# Altium project RS232-Ethernet_Bridge.PrjPcb
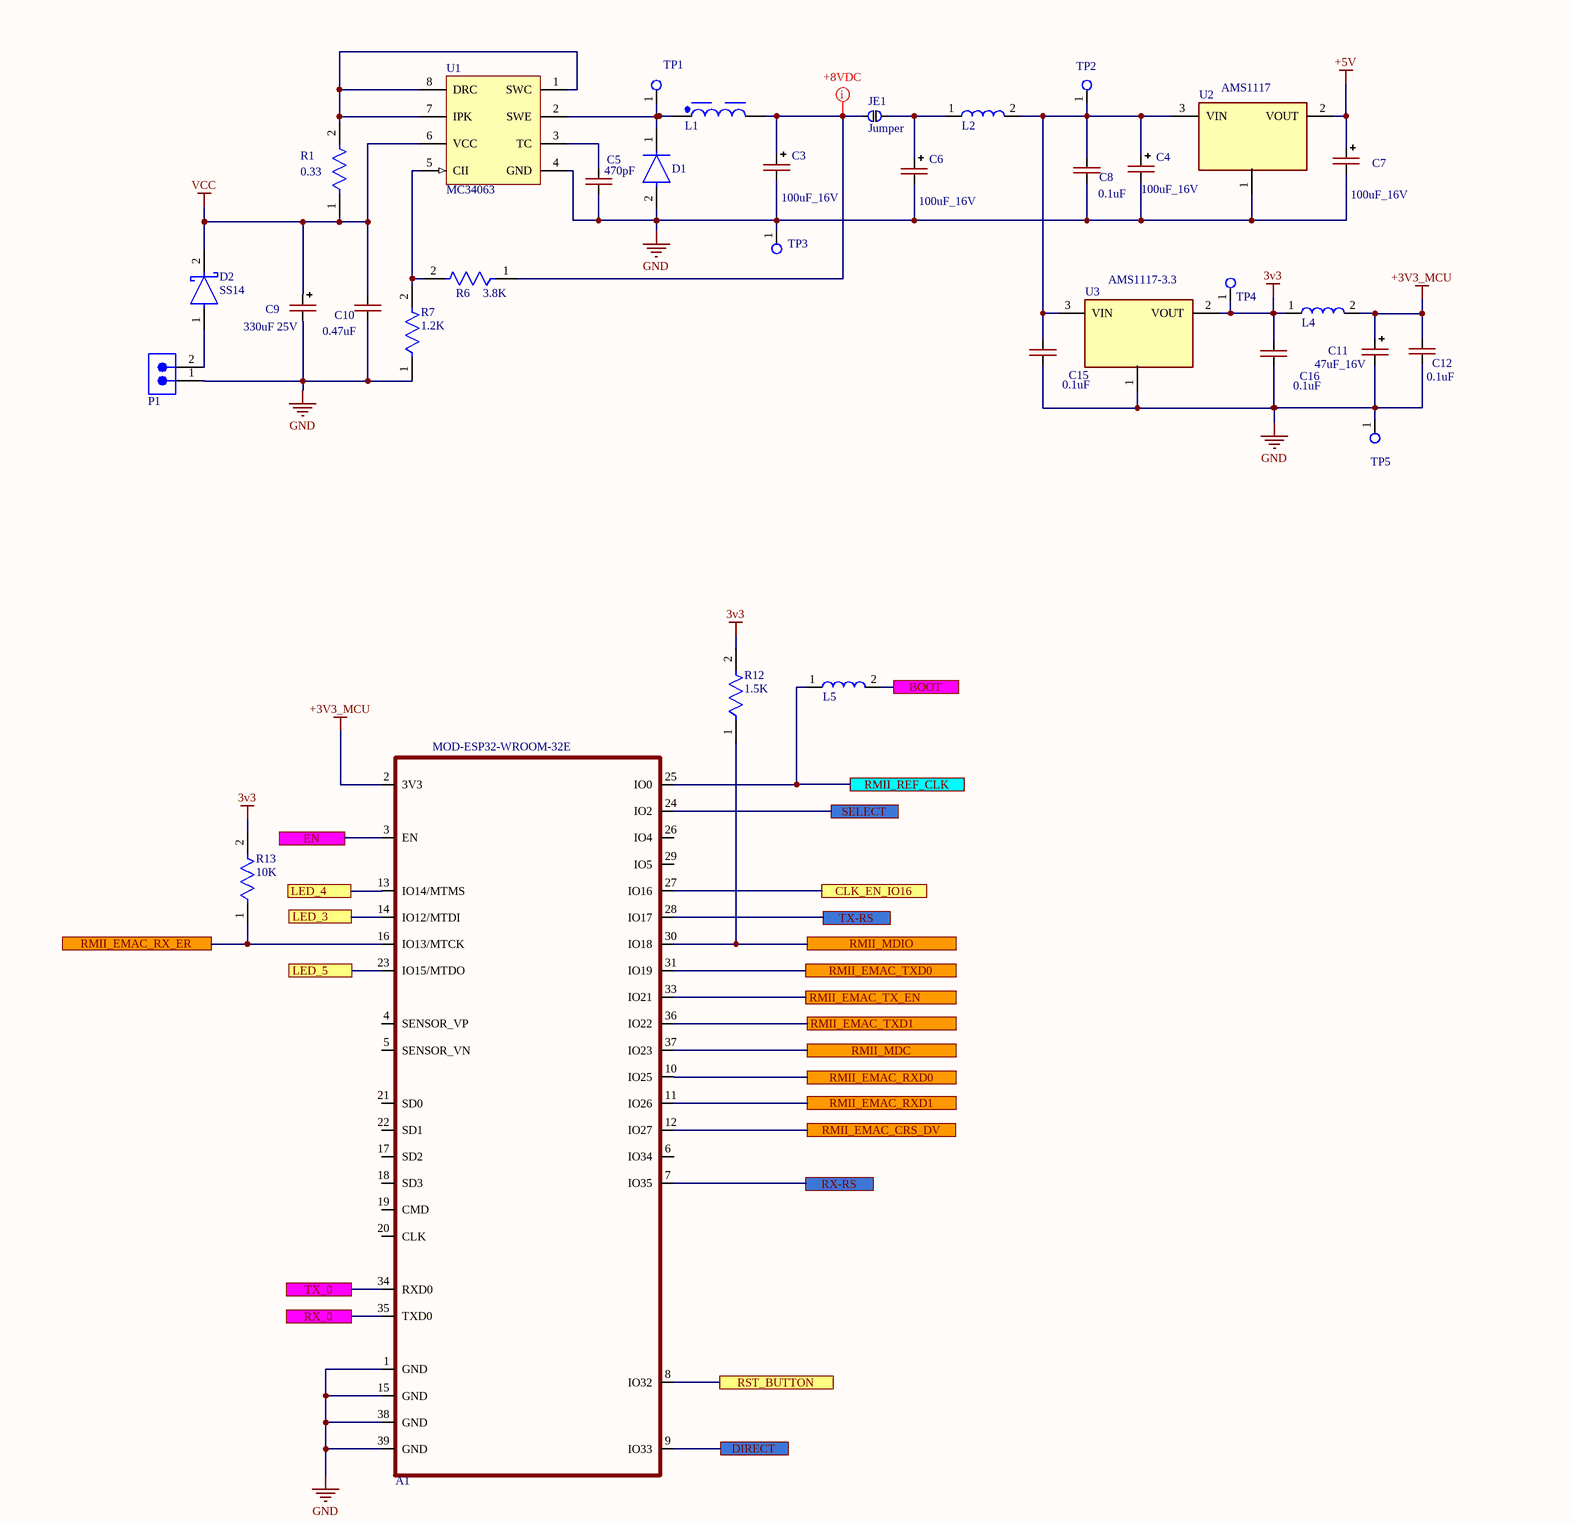
[diagram p0: Ethernet_bridge.SchDoc, top left]
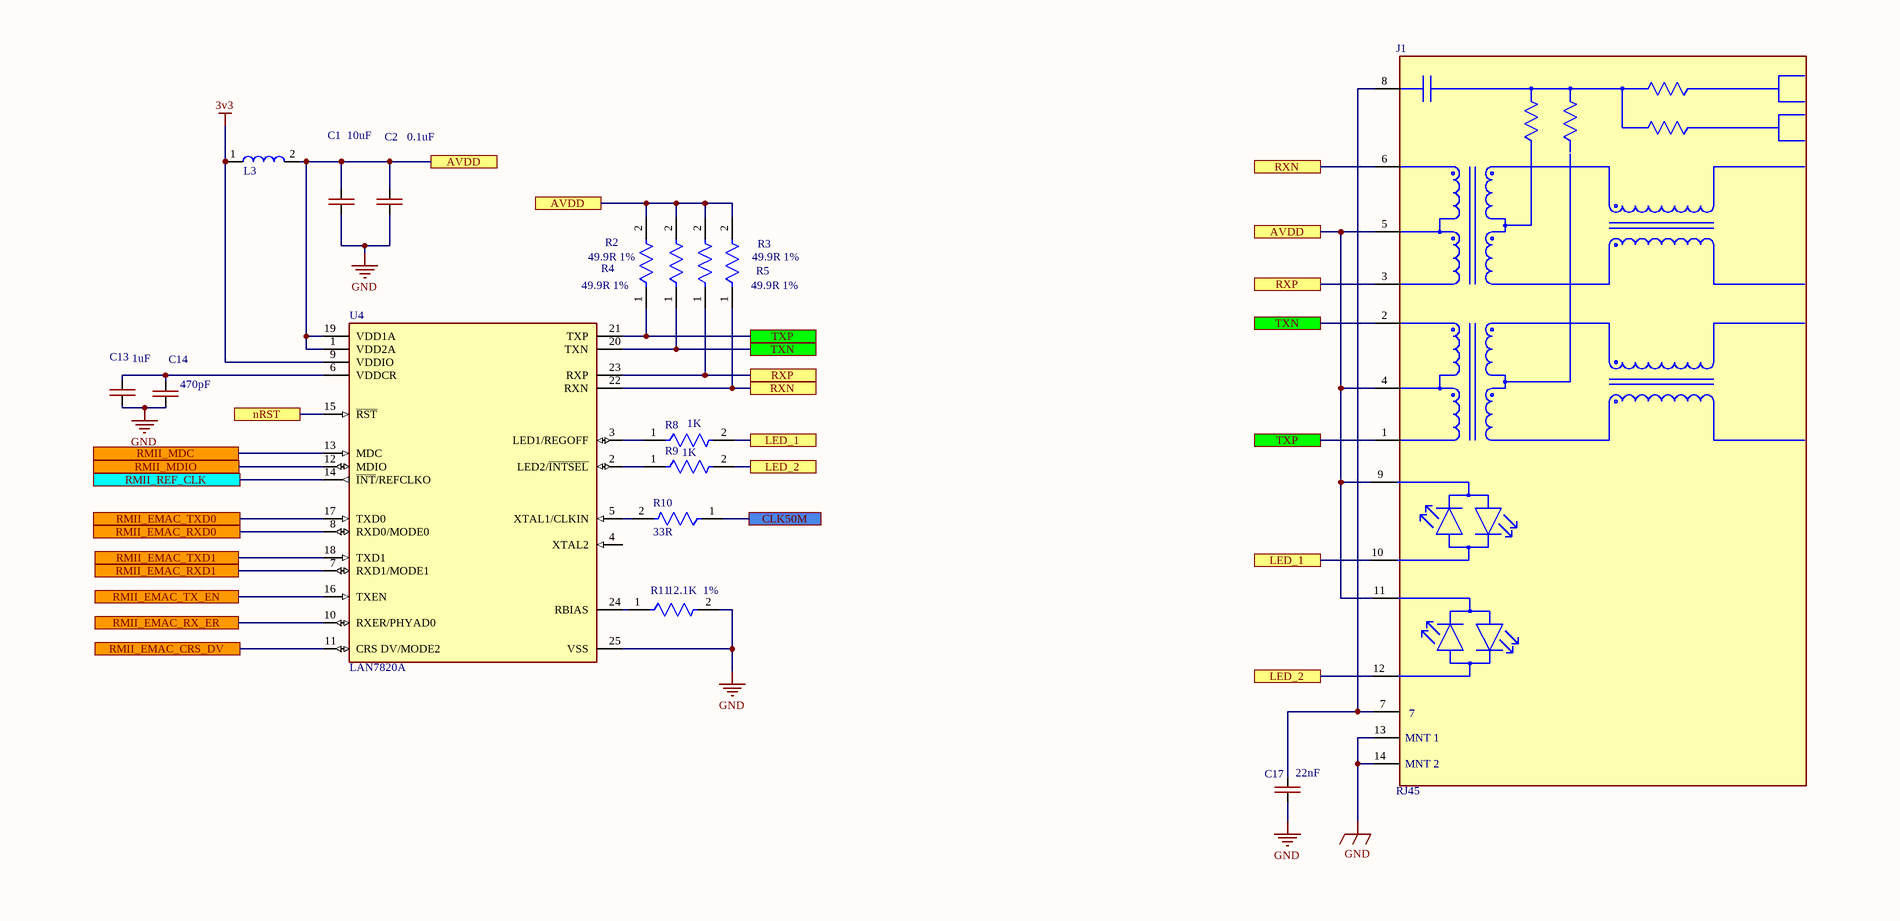
[diagram p1: Ethernet_bridge.SchDoc, top right]
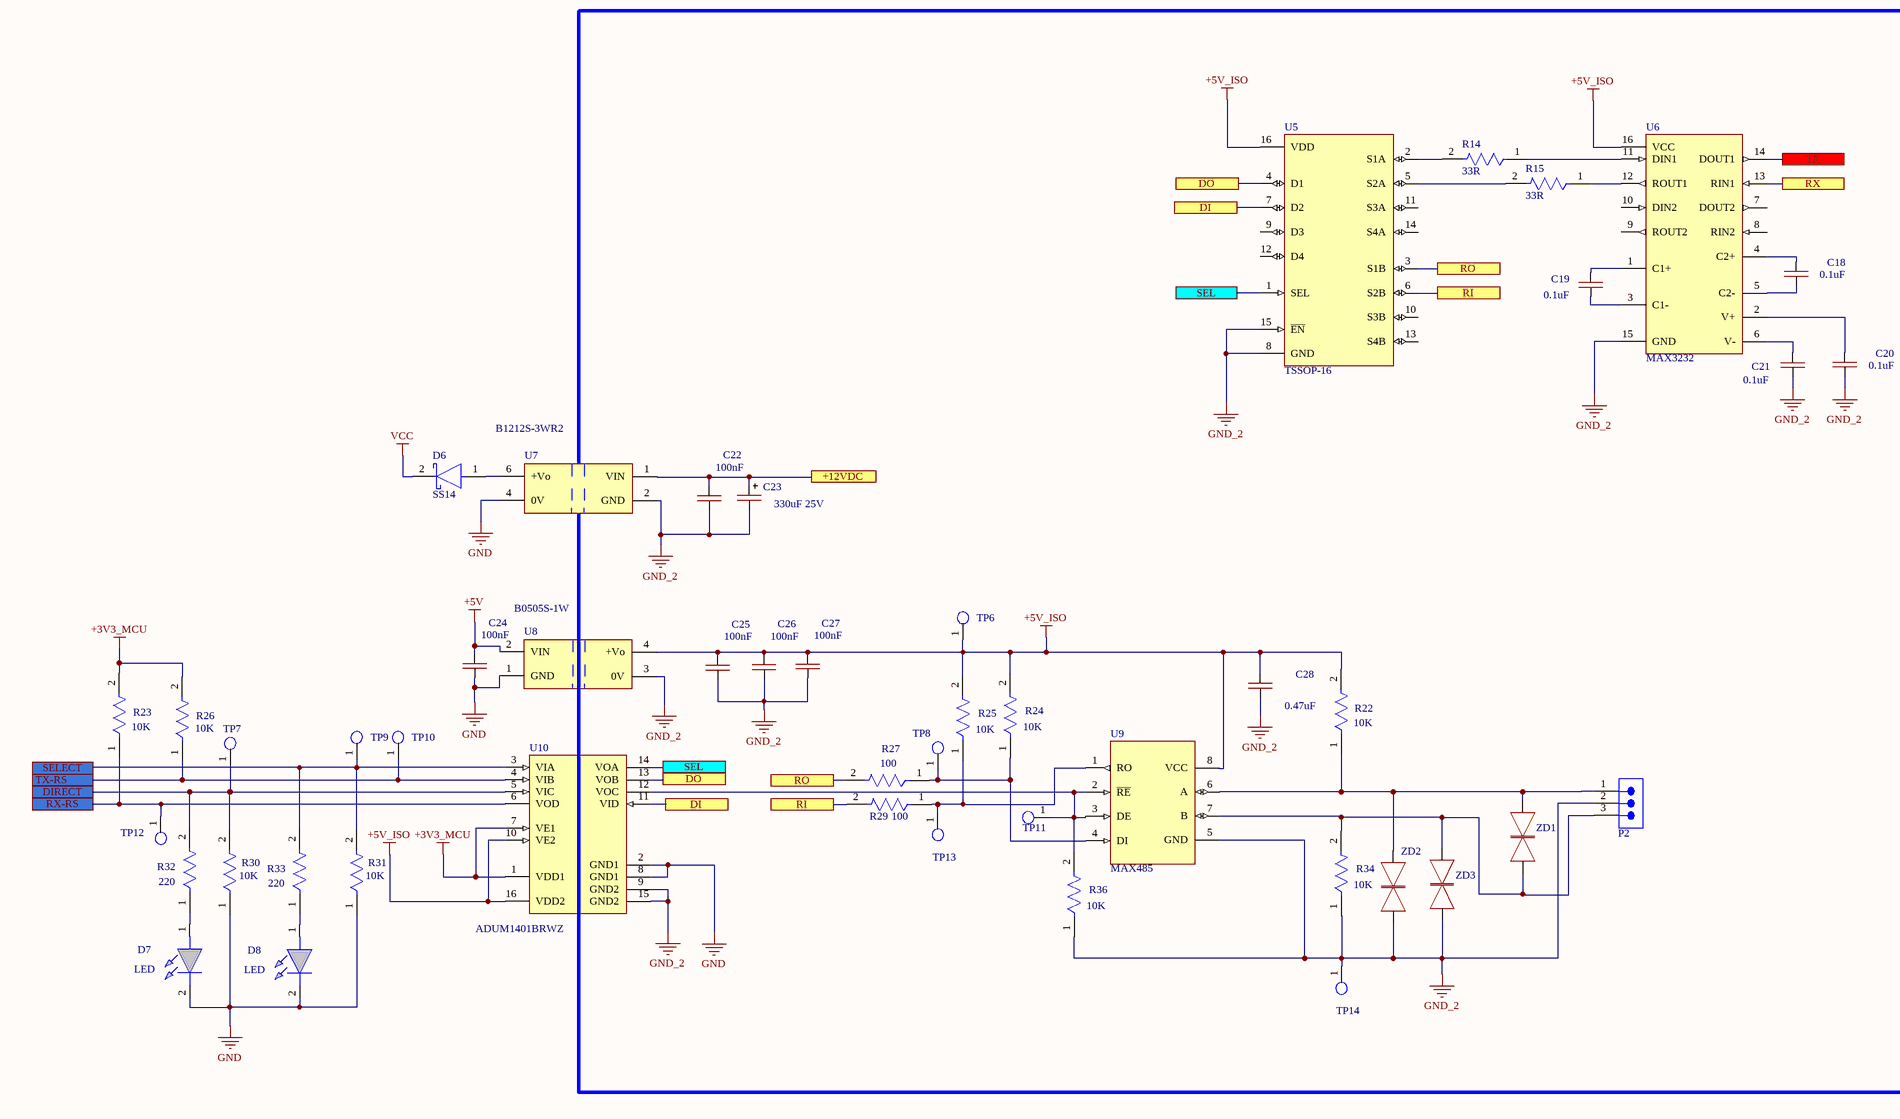
[diagram p2: Ethernet_bridge.SchDoc, bottom left]
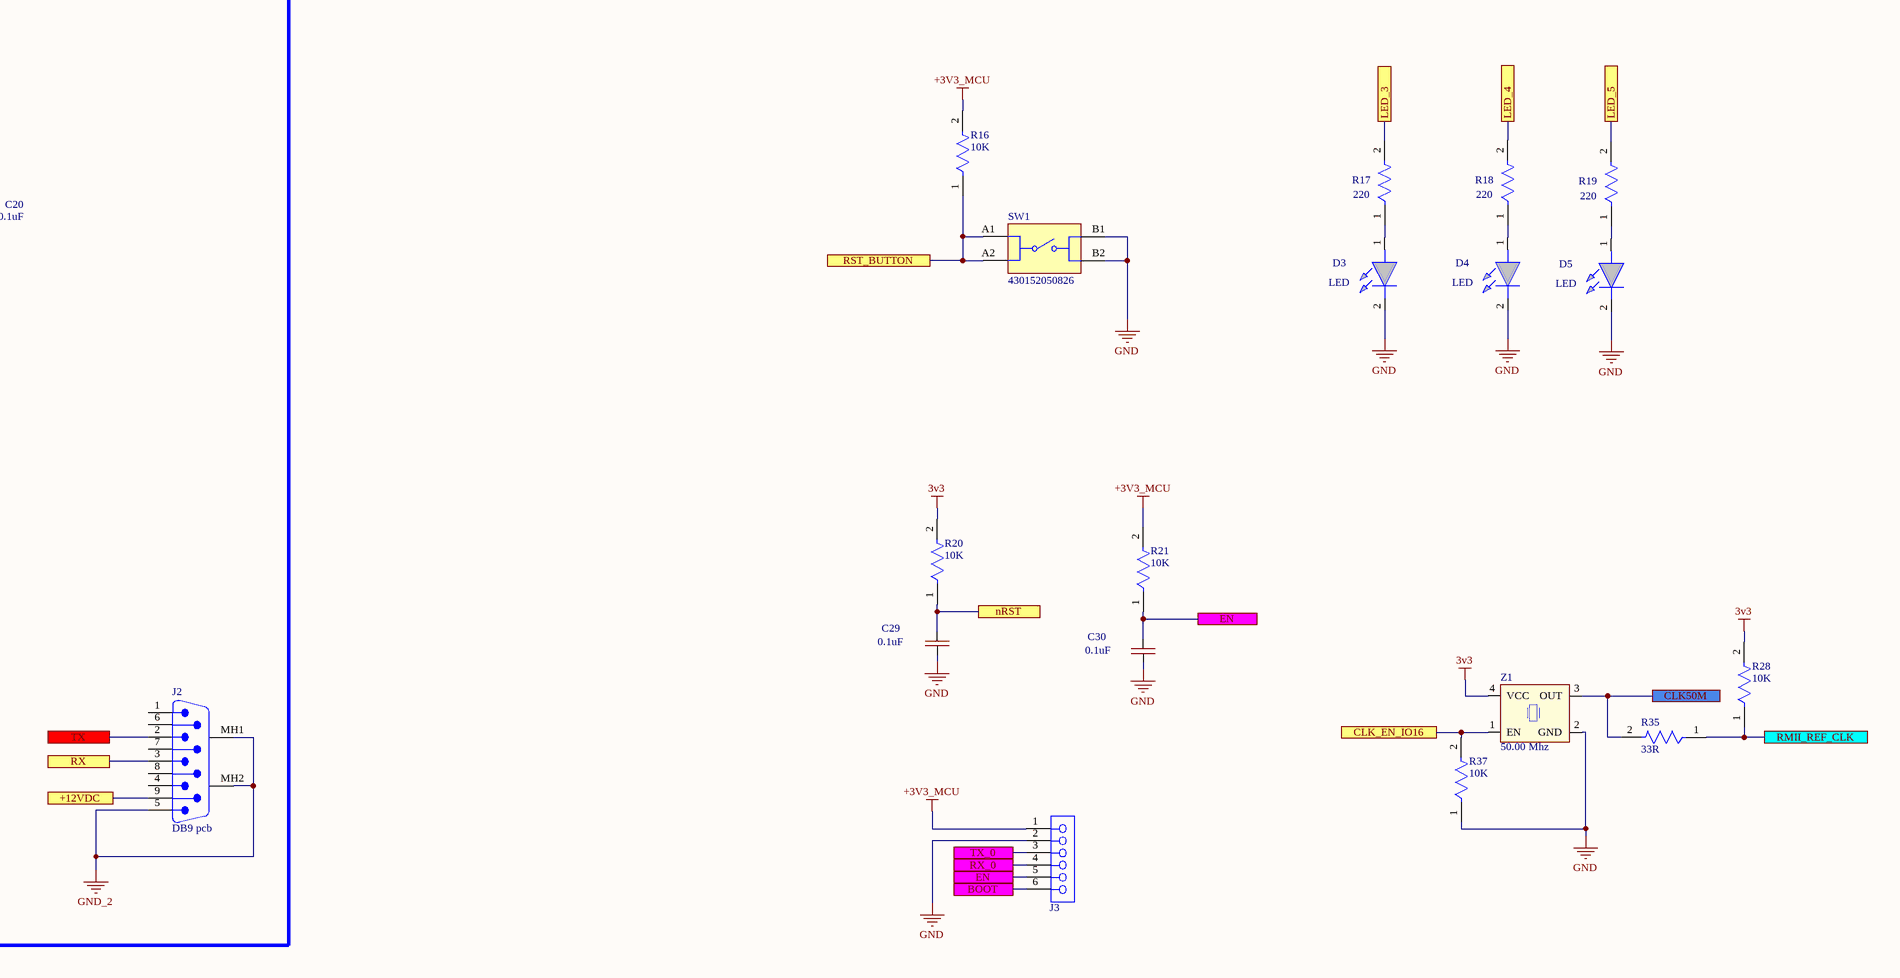
[diagram p3: Ethernet_bridge.SchDoc, bottom right]
1 sheet, 116 parts. Net scope: flat (ports and power ports of the same name join across sheets).
Board file: Ethernet_bridge.PcbDoc

## Sheet Ethernet_bridge.SchDoc
size A1; SheetNumber: 1; SheetTotal: 1; SPICEModelCacheNLVBOJOE: <root> / <DocumentId>NLVBOJOE</DocumentId> / <CacheFrame Number="0"> / <Model Name="5848_744774033_3.3u" Kind="CKT"> / <Text>******* / .subckt 5848_744774033_3.3u 1 2 / Rp 1 2 12000 / Cp 1 2 3.4p / Rs 1 N3 0.042 / L1 N3 2 3.3u / .ends 5848_744774033_3.3u</Text> / </Model> / </CacheFrame> / </root>

### Parts
A1  MOD-ESP32-WROOM-32E  [MOD-ESP32-WROOM-32E]
C1  10uF  [CAP-0805]
C2  0.1uF  [CAP-0805]
C3  100uF_16V  [CAP-TAN-D]
C4  100uF_16V  [CAP-TAN-D]
C5  470pF  [CAP-0805]
C6  100uF_16V  [CAP-TAN-D]
C7  100uF_16V  [CAP-TAN-D]
C8  0.1uF  [CAP-0805]
C9  330uF 25V  [CAP_SMD_Size_E]
C10  0.47uF  [CAP-0805]
C11  47uF_16V  [CAP-TAN-D]
C12  0.1uF  [CAP-0805]
C13  1uF  [CAP-0805]
C14  470pF  [CAP-0805]
C15  0.1uF  [CAP-0805]
C16  0.1uF  [CAP-0805]
C17  22nF  [CAP-0805]
C18  0.1uF  [CAP-0805]
C19  0.1uF  [CAP-0805]
C20  0.1uF  [CAP-0805]
C21  0.1uF  [CAP-0805]
C22  100nF  [CAP-0805]
C23  330uF 25V  [CAP_SMD_Size_E]
C24  100nF  [CAP-0805]
C25  100nF  [CAP-0805]
C26  100nF  [CAP-0805]
C27  100nF  [CAP-0805]
C28  0.47uF  [CAP-0805]
C29  0.1uF  [CAP-0805]
C30  0.1uF  [CAP-0805]
D1  ES1G  [FP-403AE-MFG]  (value not drawn)
D2  SS14  [DO-214-AC]
D3  LED  [LED_GREEN]
D4  LED  [LED_RED]
D5  LED  [LED_RED]
D6  SS14  [DO-214-AC]
D7  LED  [LED_GREEN]
D8  LED  [LED_RED]
J1  RJ45  [RJ-45]
J2  DB9 pcb  [DB9 -2 CONN PCB]
J3  61300611821  [61300611821]  (value not drawn)
JE1  Jumper  [JE]
L1  3.3µH, 4A  [WE-PD2_5848]  (value not drawn)
L2  Coil  [Coil_4.5x4.5_mm]  (value not drawn)
L3  Coil  [Coil_4.5x4.5_mm]  (value not drawn)
L4  Coil  [Coil_4.5x4.5_mm]  (value not drawn)
L5  Coil  [Coil_4.5x4.5_mm]  (value not drawn)
P1  691305540002  [691305540002]  (value not drawn)
P2  691305540003  [691305540003]  (value not drawn)
R1  0.33  [RES-1206]
R2  49.9R 1%  [RES-0805]
R3  49.9R 1%  [RES-0805]
R4  49.9R 1%  [RES-0805]
R5  49.9R 1%  [RES-0805]
R6  3.8K  [RES-0805]
R7  1.2K  [RES-0805]
R8  1K  [RES-0805]
R9  1K  [RES-0805]
R10  33R  [RES-0805]
R11  12.1K  1%  [RES-0805]
R12  1.5K  [RES-0805]
R13  10K  [RES-0805]
R14  33R  [RES-0805]
R15  33R  [RES-0805]
R16  10K  [RES-0805]
R17  220  [RES-0805]
R18  220  [RES-0805]
R19  220  [RES-0805]
R20  10K  [RES-0805]
R21  10K  [RES-0805]
R22  10K  [RES-0805]
R23  10K  [RES-0805]
R24  10K  [RES-0805]
R25  10K  [RES-0805]
R26  10K  [RES-0805]
R27  100  [RES-0805]
R28  10K  [RES-0805]
R29  100  [RES-0805]
R30  10K  [RES-0805]
R31  10K  [RES-0805]
R32  220  [RES-0805]
R33  220  [RES-0805]
R34  10K  [RES-0805]
R35  33R  [RES-0805]
R36  10K  [RES-0805]
R37  10K  [RES-0805]
SW1  430152050826  [430152050826]
TP1  Test_Point_PCB  [Test_Point]  (value not drawn)
TP2  Test_Point_PCB  [Test_Point]  (value not drawn)
TP3  Test_Point_PCB  [Pin_Test_Point(Orange)]  (value not drawn)
TP4  Test_Point_PCB  [Test_Point]  (value not drawn)
TP5  Test_Point_PCB  [Pin_Test_Point(Pink)]  (value not drawn)
TP6  Test_Point_PCB  [Test_Point]  (value not drawn)
TP7  Test_Point_PCB  [Test_Point]  (value not drawn)
TP8  Test_Point_PCB  [Test_Point]  (value not drawn)
TP9  Test_Point_PCB  [Test_Point]  (value not drawn)
TP10  Test_Point_PCB  [Test_Point]  (value not drawn)
TP11  Test_Point_PCB  [Test_Point]  (value not drawn)
TP12  Test_Point_PCB  [Test_Point]  (value not drawn)
TP13  (no value)  [Test_Point]
TP14  Test_Point_PCB  [Test_Point]  (value not drawn)
U1  MC34063  [SOIC-8_M]
U2  AMS1117  [SOT-89]
U3  AMS1117-3.3  [SOT-223]
U4  LAN7820A  [24QFN-4x4B-IPC_A]
U5  TSSOP-16  [TSSOP-16-A]
U6  MAX3232  [SOIC-16-M]
U7  B1212S-3WR2  [B1212S-3WR2]
U8  B0505S-1W  [B0505S-1W]
U9  MAX485  [SOIC-8-MFG]
U10  ADUM1401BRWZ  [ADI-RW-16_M]
Z1  50.00 Mhz  [50.00Mhz active quartz]
ZD1  P6SMB16CA  [DO-214AA]  (value not drawn)
ZD2  P6SMB16CA  [DO-214AA]  (value not drawn)
ZD3  P6SMB16CA  [DO-214AA]  (value not drawn)

### Ports
+12VDC (see Ethernet_bridge[3C]), +12VDC (see Ethernet_bridge[7D]), AVDD (see Ethernet_bridge[8A]), AVDD (see Ethernet_bridge[8A], Ethernet_bridge[10A]), BOOT (see Ethernet_bridge[3B]), BOOT (see Ethernet_bridge[9D]), CLK50M (see Ethernet_bridge[9A]), CLK50M (see Ethernet_bridge[12D]), CLK_EN_IO16 (see Ethernet_bridge[3B]), CLK_EN_IO16 (see Ethernet_bridge[11D]), DI (see Ethernet_bridge[3D]), DI (see Ethernet_bridge[4C]), DIRECT (see Ethernet_bridge[1D]), DIRECT (see Ethernet_bridge[3C]), DO (see Ethernet_bridge[3D]), DO (see Ethernet_bridge[4C]), EN (see Ethernet_bridge[1B], Ethernet_bridge[9D]), EN (see Ethernet_bridge[1B], Ethernet_bridge[10D]), EN (see Ethernet_bridge[9D], Ethernet_bridge[10D]), LED_1 (see Ethernet_bridge[9A]), LED_1 (see Ethernet_bridge[10A]), LED_2 (see Ethernet_bridge[9A]), LED_2 (see Ethernet_bridge[10B]), LED_3 (see Ethernet_bridge[1B]), LED_3 (see Ethernet_bridge[11C]), LED_4 (see Ethernet_bridge[1B]), LED_4 (see Ethernet_bridge[11C]), LED_5 (see Ethernet_bridge[1B]), LED_5 (see Ethernet_bridge[12C]), nRST (see Ethernet_bridge[7A]), nRST (see Ethernet_bridge[10D]), RI (see Ethernet_bridge[3D]), RI (see Ethernet_bridge[5C]), RMII_EMAC_CRS_DV (see Ethernet_bridge[3B]), RMII_EMAC_CRS_DV (see Ethernet_bridge[7B]), RMII_EMAC_RX_ER (see Ethernet_bridge[1B]), RMII_EMAC_RX_ER (see Ethernet_bridge[7A]), RMII_EMAC_RXD0 (see Ethernet_bridge[3B]), RMII_EMAC_RXD0 (see Ethernet_bridge[7A]), RMII_EMAC_RXD1 (see Ethernet_bridge[3B]), RMII_EMAC_RXD1 (see Ethernet_bridge[7A]), RMII_EMAC_TX_EN (see Ethernet_bridge[3B]), RMII_EMAC_TX_EN (see Ethernet_bridge[7A]), RMII_EMAC_TXD0 (see Ethernet_bridge[3B]), RMII_EMAC_TXD0 (see Ethernet_bridge[7A]), RMII_EMAC_TXD1 (see Ethernet_bridge[3B]), RMII_EMAC_TXD1 (see Ethernet_bridge[7A]), RMII_MDC (see Ethernet_bridge[3B]), RMII_MDC (see Ethernet_bridge[7A]), RMII_MDIO (see Ethernet_bridge[3B]), RMII_MDIO (see Ethernet_bridge[7A]), RMII_REF_CLK (see Ethernet_bridge[3B], Ethernet_bridge[7A]), RMII_REF_CLK (see Ethernet_bridge[3B], Ethernet_bridge[12D]), RMII_REF_CLK (see Ethernet_bridge[7A], Ethernet_bridge[12D]), RO (see Ethernet_bridge[3D]), RO (see Ethernet_bridge[5C]), RST_BUTTON (see Ethernet_bridge[3B]), RST_BUTTON (see Ethernet_bridge[9C]), RX (see Ethernet_bridge[6C]), RX (see Ethernet_bridge[7D]), RX-RS (see Ethernet_bridge[1D]), RX-RS (see Ethernet_bridge[3B]), RX_0 (see Ethernet_bridge[1B]), RX_0 (see Ethernet_bridge[9D]), RXN (see Ethernet_bridge[9A]), RXN (see Ethernet_bridge[10A]), RXP (see Ethernet_bridge[9A]), RXP (see Ethernet_bridge[10A]), SEL (see Ethernet_bridge[3D]), SEL (see Ethernet_bridge[4C]), SELECT (see Ethernet_bridge[1D]), SELECT (see Ethernet_bridge[3B]), TX (see Ethernet_bridge[6C]), TX (see Ethernet_bridge[7D]), TX-RS (see Ethernet_bridge[1D]), TX-RS (see Ethernet_bridge[3B]), TX_0 (see Ethernet_bridge[1B]), TX_0 (see Ethernet_bridge[9D]), TXN (see Ethernet_bridge[9A]), TXN (see Ethernet_bridge[10A]), TXP (see Ethernet_bridge[9A]), TXP (see Ethernet_bridge[10A])

### Nets
3v3: C16.2 L3.1 L4.1 R12.2 R13.2 R20.2 R28.2 TP4.1(G9) U3.2(VOUT) U4.9(VDDIO) Z1.4(VCC)
+3V3_MCU: A1.2(3V3) C11.1(+) C12.2 J3.1 L4.2 R16.2 R21.2 R23.2 R26.2 U10.1(VDD1) U10.7(VE1)
+5V: C7.1(+) C24.2 U2.2(VOUT) U8.2(VIN)
+5V_ISO: C25.2 C26.2 C27.2 C28.1 R22.2 R24.2 R25.2 TP6.1(G9) U5.16(VDD) U6.16(VCC) U8.4(+Vo) U9.8(VCC) U10.10(VE2) U10.16(VDD2)
GND: A1.1(GND) A1.15(GND) A1.38(GND) A1.39(GND) C1.1 C2.1 C3.2(-) C4.2(-) C5.2 C6.2(-) C7.2(-) C8.1 C9.2(-) C10.2 C11.2(-) C12.1 C13.1 C14.1 C15.1 C16.1 C17.1 C24.1 C29.1 C30.1 D1.2(A) D3.2(K) D4.2(K) D5.2(K) D7.2(K) D8.2(K) J1.13(MNT_1) J1.14(MNT_2) J3.2 P1.1 R7.1 R11.2 R30.1 R31.1 R37.1 SW1.B1 SW1.B2 TP3.1(G9) TP5.1(G9) U1.4(GND) U2.1(Ground) U3.1(Ground) U4.25(VSS) U7.4(0V) U8.1(GND) U10.2(GND1) U10.8(GND1) Z1.2(GND)
GND_2: C20.1 C21.1 C22.1 C23.2(-) C25.1 C26.1 C27.1 C28.2 J2.5 J2.MH1 J2.MH2 P2.2 R34.1 R36.1 TP14.1(G9) U5.8(GND) U5.15(~{EN}) U6.15(GND) U7.2(GND) U8.3(0V) U9.5(GND) U10.9(GND2) U10.15(GND2) ZD2.1(A) ZD3.1(A)
VCC: C9.1(+) C10.1 D2.2(C) D6.2(C) R1.1 U1.6(VCC)
NetA1_3: A1.3(EN) C30.2 J3.5 R21.1 ; port EN
NetA1_7: A1.7(IO35) R23.1 TP12.1(G9) U10.6(VOD) ; port RX-RS
NetA1_8: A1.8(IO32) R16.1 SW1.A1 SW1.A2 ; port RST_BUTTON
NetA1_9: A1.9(IO33) R30.2 R32.2 TP7.1(G9) U10.5(VIC) ; port DIRECT
NetA1_10: A1.10(IO25) U4.8(RXD0/MODE0) ; port RMII_EMAC_RXD0
NetA1_11: A1.11(IO26) U4.7(RXD1/MODE1) ; port RMII_EMAC_RXD1
NetA1_12: A1.12(IO27) U4.11(CRS_DV/MODE2) ; port RMII_EMAC_CRS_DV
NetA1_13: A1.13(IO14/MTMS) R18.2 ; port LED_4
NetA1_14: A1.14(IO12/MTDI) R17.2 ; port LED_3
NetA1_16: A1.16(IO13/MTCK) R13.1 U4.10(RXER/PHYAD0) ; port RMII_EMAC_RX_ER
NetA1_23: A1.23(IO15/MTDO) R19.2 ; port LED_5
NetA1_24: A1.24(IO2) R31.2 R33.2 TP9.1(G9) U10.3(VIA) ; port SELECT
NetA1_25: A1.25(IO0) L5.1 R28.1 R35.1 U4.14(~{INT}/REFCLKO) ; port RMII_REF_CLK
NetA1_27: A1.27(IO16) R37.2 Z1.1(EN) ; port CLK_EN_IO16
NetA1_28: A1.28(IO17) R26.1 TP10.1(G9) U10.4(VIB) ; port TX-RS
NetA1_30: A1.30(IO18) R12.1 U4.12(MDIO) ; port RMII_MDIO
NetA1_31: A1.31(IO19) U4.17(TXD0) ; port RMII_EMAC_TXD0
NetA1_33: A1.33(IO21) U4.16(TXEN) ; port RMII_EMAC_TX_EN
NetA1_34: A1.34(RXD0) J3.3 ; port TX_0
NetA1_35: A1.35(TXD0) J3.4 ; port RX_0
NetA1_36: A1.36(IO22) U4.18(TXD1) ; port RMII_EMAC_TXD1
NetA1_37: A1.37(IO23) U4.13(MDC) ; port RMII_MDC
NetC1_2: C1.2 C2.2 J1.4 J1.5 J1.9(2_ANODE_YELLOW/CATHODE_GREEN) J1.11(2_ANODE_YELLOW/CATHODE_GREEN) L3.2 R2.2 R3.2 R4.2 R5.2 U4.1(VDD2A) U4.19(VDD1A) ; port AVDD
NetC3_1: C3.1(+) JE1.2 L1.2 R6.1
NetC4_1: C4.1(+) C8.2 C15.2 L2.2 TP2.1(G9) U2.3(VIN) U3.3(VIN)
NetC5_1: C5.1 U1.3(TC)
NetC6_1: C6.1(+) JE1.1 L2.1
NetC13_2: C13.2 C14.2 U4.6(VDDCR)
NetC17_2: C17.2 J1.7 J1.8
NetC18_1: C18.1 U6.5(C2-)
NetC18_2: C18.2 U6.4(C2+)
NetC19_1: C19.1 U6.3(C1-)
NetC19_2: C19.2 U6.1(C1+)
NetC20_2: C20.2 U6.2(V+)
NetC21_2: C21.2 U6.6(V-)
NetC22_2: C22.2 C23.1(+) J2.9 U7.1(VIN) ; port +12VDC
NetC29_2: C29.2 R20.1 U4.15(~{RST}) ; port nRST
NetD1_1: D1.1(C) L1.1 TP1.1(G9) U1.2(SWE)
NetD2_1: D2.1(A) P1.2
NetD3_1: D3.1(A) R17.1
NetD4_1: D4.1(A) R18.1
NetD5_1: D5.1(A) R19.1
NetD6_1: D6.1(A) U7.6(+Vo)
NetD7_1: D7.1(A) R32.1
NetD8_1: D8.1(A) R33.1
NetJ1_1: J1.1 R2.1 U4.21(TXP) ; port TXP
NetJ1_2: J1.2 R4.1 U4.20(TXN) ; port TXN
NetJ1_3: J1.3 R3.1 U4.23(RXP) ; port RXP
NetJ1_6: J1.6 R5.1 U4.22(RXN) ; port RXN
NetJ1_10: J1.10(2_CATHODE_YELLOW/ANODE_GREEN) R8.2 ; port LED_1
NetJ1_12: J1.12(2_CATHODE_YELLOW/ANODE_GREEN) R9.2 ; port LED_2
NetJ2_2: J2.2 U6.14(DOUT1) ; port TX
NetJ2_3: J2.3 U6.13(RIN1) ; port RX
NetJ3_6: J3.6 L5.2 ; port BOOT
NetP2_1: P2.1 R22.1 U9.6(A) ZD1.2(A) ZD2.2(A)
NetP2_3: P2.3 R34.2 U9.7(B) ZD1.1(A) ZD3.2(A)
NetR1_2: R1.2 U1.1(SWC) U1.7(IPK) U1.8(DRC)
NetR6_2: R6.2 R7.2 U1.5(CII)
NetR8_1: R8.1 U4.3(LED1/REGOFF)
NetR9_1: R9.1 U4.2(LED2/~{INTSEL})
NetR10_1: R10.1 R35.2 Z1.3(OUT) ; port CLK50M
NetR10_2: R10.2 U4.5(XTAL1/CLKIN)
NetR11_1: R11.1 U4.24(RBIAS)
NetR14_1: R14.1 U6.11(DIN1)
NetR14_2: R14.2 U5.2(S1A)
NetR15_1: R15.1 U6.12(ROUT1)
NetR15_2: R15.2 U5.5(S2A)
NetR24_1: R24.1 R27.1 TP8.1(G9) U9.4(DI)
NetR25_1: R25.1 R29.1 TP13.1(G9) U9.1(RO)
NetR27_2: R27.2 U5.3(S1B) ; port RO
NetR29_2: R29.2 U5.6(S2B) ; port RI
NetR36_2: R36.2 TP11.1(G9) U9.2(~{RE}) U9.3(DE) U10.12(VOC)
NetU5_1: U5.1(SEL) U10.14(VOA) ; port SEL
NetU5_4: U5.4(D1) U10.13(VOB) ; port DO
NetU5_7: U5.7(D2) U10.11(VID) ; port DI

Not connected (* = marked no-connect by the designer): A1 4(SENSOR_VP) 5(SENSOR_VN) 6(IO34) 17(SD2) 18(SD3) 19(CMD) 20(CLK) 21(SD0) 22(SD1) 26(IO4) 29(IO5); J2 1 4 6 7 8; U4 4(XTAL2); U5 9(D3) 10(S3B) 11(S3A) 12(D4) 13(S4B) 14(S4A); U6 7(DOUT2) 8(RIN2) 9(ROUT2) 10(DIN2)

### Layout directives
mark named +8VDC: (no net found under the mark)

### Library data of the parts
C1 C2 C5 C8 C10 C12-C22 C24-C30 = CAP-NON-POLAR
C3 C4 C6 C7 C9 C23 = CAP_POL_SMD
C11 = CAP-POLAR
D1 = ES1G: Ultrafast
D3-D5 D7 D8 = LED: WURTH ELEKTRONIK - 151031YS06000 - LED, Yellow, Through Hole, T-1 (3mm), 30 mA, 2 V, 590 nm; Geometry.Height: 5.5mm; Manufacturer_Name: Wurth Elektronik; Manufacturer_Part_Number: 151031YS06000; Mouser Part Number: 710-151031YS06000; Mouser Price/Stock: https://www.mouser.co.uk/ProductDetail/Wurth-Elektronik/151031YS06000?qs=LlUlMxKIyB3xSYYW%252BcuBiQ%3D%3D; Arrow Part Number: *; Arrow Price/Stock: *; Mouser Testing Part Number: *; Mouser Testing Price/Stock: *; Datasheet Link: https://katalog.we-online.de/led/datasheet/151031YS06000.pdf
J1 = HRK1-1B72F09
J2 = DB9
J3 = 61300611821: WR-PHD Socket Header, THT, Vertical, pitch 2.54mm, 1 Row, 6P; Manufacturer: Wurth Elektronik; Contact Resistance: 20mΩ; Rated Current: 3A; Working Voltage: 250V; Withstanding Voltage: 500V; ComponentLink1Description: Website Link; ComponentLink1URL: https://www.we-online.com/redexpert/article/61300611821?ad; ComponentLink2Description: Datasheet Link; ComponentLink2URL: https://www.we-online.com/redexpert/spec/61300611821?ad; Manufacturer Part Number: 61300611821; Category: Board-to-Board Connectors; Match Code: WR-PHD; Mount: Through Hole; Operating Temperature Max: 125°C; Operating Temperature Min: -40°C; Packaging: Tray; Gender: Socket Header; Number of Pins: 6; Number of Rows: 1; Orientation: Vertical; Pitch: 2.54mm
JE1 = JE
L1 = 744774033: WE-PD2 SMT Power Inductor, size 5848, 3.3µH, 4A, 0.06Ω; Manufacturer: Wurth Elektronik; Case/Size Code: 5848; DC Resistance: 0.042Ω; Saturation Current: 7.5A; Self Resonant Frequency: 43MHz; Manufacturer Part Number: 744774033; Category: Unshielded Power Inductors; Match Code: WE-PD2; ComponentLink1Description: Website Link; ComponentLink1URL: https://www.we-online.com/redexpert/article/744774033?ad; ComponentLink2Description: Datasheet Link; ComponentLink2URL: https://www.we-online.com/redexpert/spec/744774033?ad; Mount: Surface Mount; Operating Temperature Max: 125°C; Operating Temperature Min: -40°C; Packaging: Tape and Reel; Length: 5.8mm; Width: 5.2mm; Height: 4.5mm; DC Resistance Max: 0.06Ω; Inductance: 3.3µH; Rated Current: 4A
P1 = 691305540002: WR-TBL Series 3055 PCB Header Horizontal Entry with Plastic Latches, THT, pitch 5.08mm, 2p; Manufacturer: Wurth Elektronik; Modularity: No; Rated Current: 16A; Working Voltage: 300V; ComponentLink1Description: Website Link; ComponentLink1URL: https://www.we-online.com/redexpert/article/691305540002?ad; ComponentLink2Description: Datasheet Link; ComponentLink2URL: https://www.we-online.com/redexpert/spec/691305540002?ad; Manufacturer Part Number: 691305540002; Category: Terminal Blocks; Match Code: WR-TBL; Mount: Through Hole; Operating Temperature Max: 105°C; Operating Temperature Min: -40°C; Packaging: Box; Application: Pluggable; Number of Pins: 2; Number of Rows: 1; Orientation: Horizontal; Pitch: 5.08mm
P2 = 691305540003: WR-TBL Series 3055 PCB Header Horizontal Entry with Plastic Latches, THT, pitch 5.08mm, 3p; Manufacturer: Wurth Elektronik; Modularity: No; Rated Current: 16A; Working Voltage: 300V; ComponentLink1Description: Website Link; ComponentLink1URL: https://www.we-online.com/redexpert/article/691305540003?ad; ComponentLink2Description: Datasheet Link; ComponentLink2URL: https://www.we-online.com/redexpert/spec/691305540003?ad; Manufacturer Part Number: 691305540003; Category: Terminal Blocks; Match Code: WR-TBL; Mount: Through Hole; Operating Temperature Max: 105°C; Operating Temperature Min: -40°C; Packaging: Box; Application: Pluggable; Number of Pins: 3; Number of Rows: 1; Orientation: Horizontal; Pitch: 5.08mm
R1-R5 R7-R10 R12-R37 = RES-CONST
R6 = RES-CONST: 10K
R11 = RES-CONST: 12.1K
SW1 = 430152050826: WS-TASV SMT Tact Switch, 6mm x 6mm, 260gf, SPST-NO, 12V, 50mA; Manufacturer: Wurth Elektronik; Washable: No; Manufacturer Part Number: 430152050826; Category: Tact Switch; Match Code: WS-TASV; ComponentLink1Description: Website Link; ComponentLink1URL: https://www.we-online.com/redexpert/article/430152050826?ad; ComponentLink2Description: Datasheet Link; ComponentLink2URL: https://www.we-online.com/redexpert/spec/430152050826?ad; Mount: Surface Mount; Min Operating Temperature: -40°C; Max Operating Temperature: 85°C; Packaging: Tape and Reel; Length: 6mm; Width: 6mm; Height: 5mm; Circuit: SPST-NO; Contact Material: Stainless Steel; Contact Plating: Silver; Operation Force: 260gf; Rated Current: 50mA; Rated Voltage (DC): 12V; Terminal Material: Copper Alloy; Terminal Plating: Silver
TP1-TP14 = TP_PCB?: Test_Point
U3 = AMS1117
U5 = TMUX1574PWR
U10 = CMP-0534-00565-1: Quad Channel Digital Isolator, 2.5 KV rms Insulation Rating, 10 Mbps Data Rate, 50 ns Delay, Industrial, 16-pin SOIC (RW-16), Tube; Manufacturer: Analog Devices; Max Data Rate: 10Mbps; ComponentLink2URL: http://www.analog.com/static/imported-files/data_sheets/ADuM1400_1401_1402.pdf; ComponentLink5Description: URL Link2; ComponentLink3URL: http://www.analog.com/static/imported-files/packages/PKG_PDF/SOIC_WIDE%20%28RW%29/RW_16.pdf; DatasheetVersion: Rev. H; ComponentLink2Description: Datasheet; ComponentLink3Description: Package Specification; PartNumber: ADUM1401BRWZ; ComponentLink5URL: Reference Circuit:http://www.analog.com/en/interface-isolation/digital-isolators/adum1401/products/product.html#product-recommendations; Max Operating Temp (degreesC): 125; PackageReference: RW-16; PackageVersion: 032707-B, 03/2007; ComponentLink1Description: Manufacturer URL; Code_JEDEC: MS-013-AA; PackageDescription: 16-Pin Standard Small Outline Package, Body 10.3 x 7.5 mm, Pitch 1.27 mm; Mounting Technology: Surface Mount; ComponentLink1URL: http://www.analog.com/en/index.html; ComponentLink4Description: URL Link1; ComponentLink4URL: Product URL:http://www.analog.com/en/interface-isolation/digital-isolators/adum1401/products/product.html
Z1 = Crystal_50Mhz_active